# Altium schematic sheet Weather station GSM.SchDoc
size A3
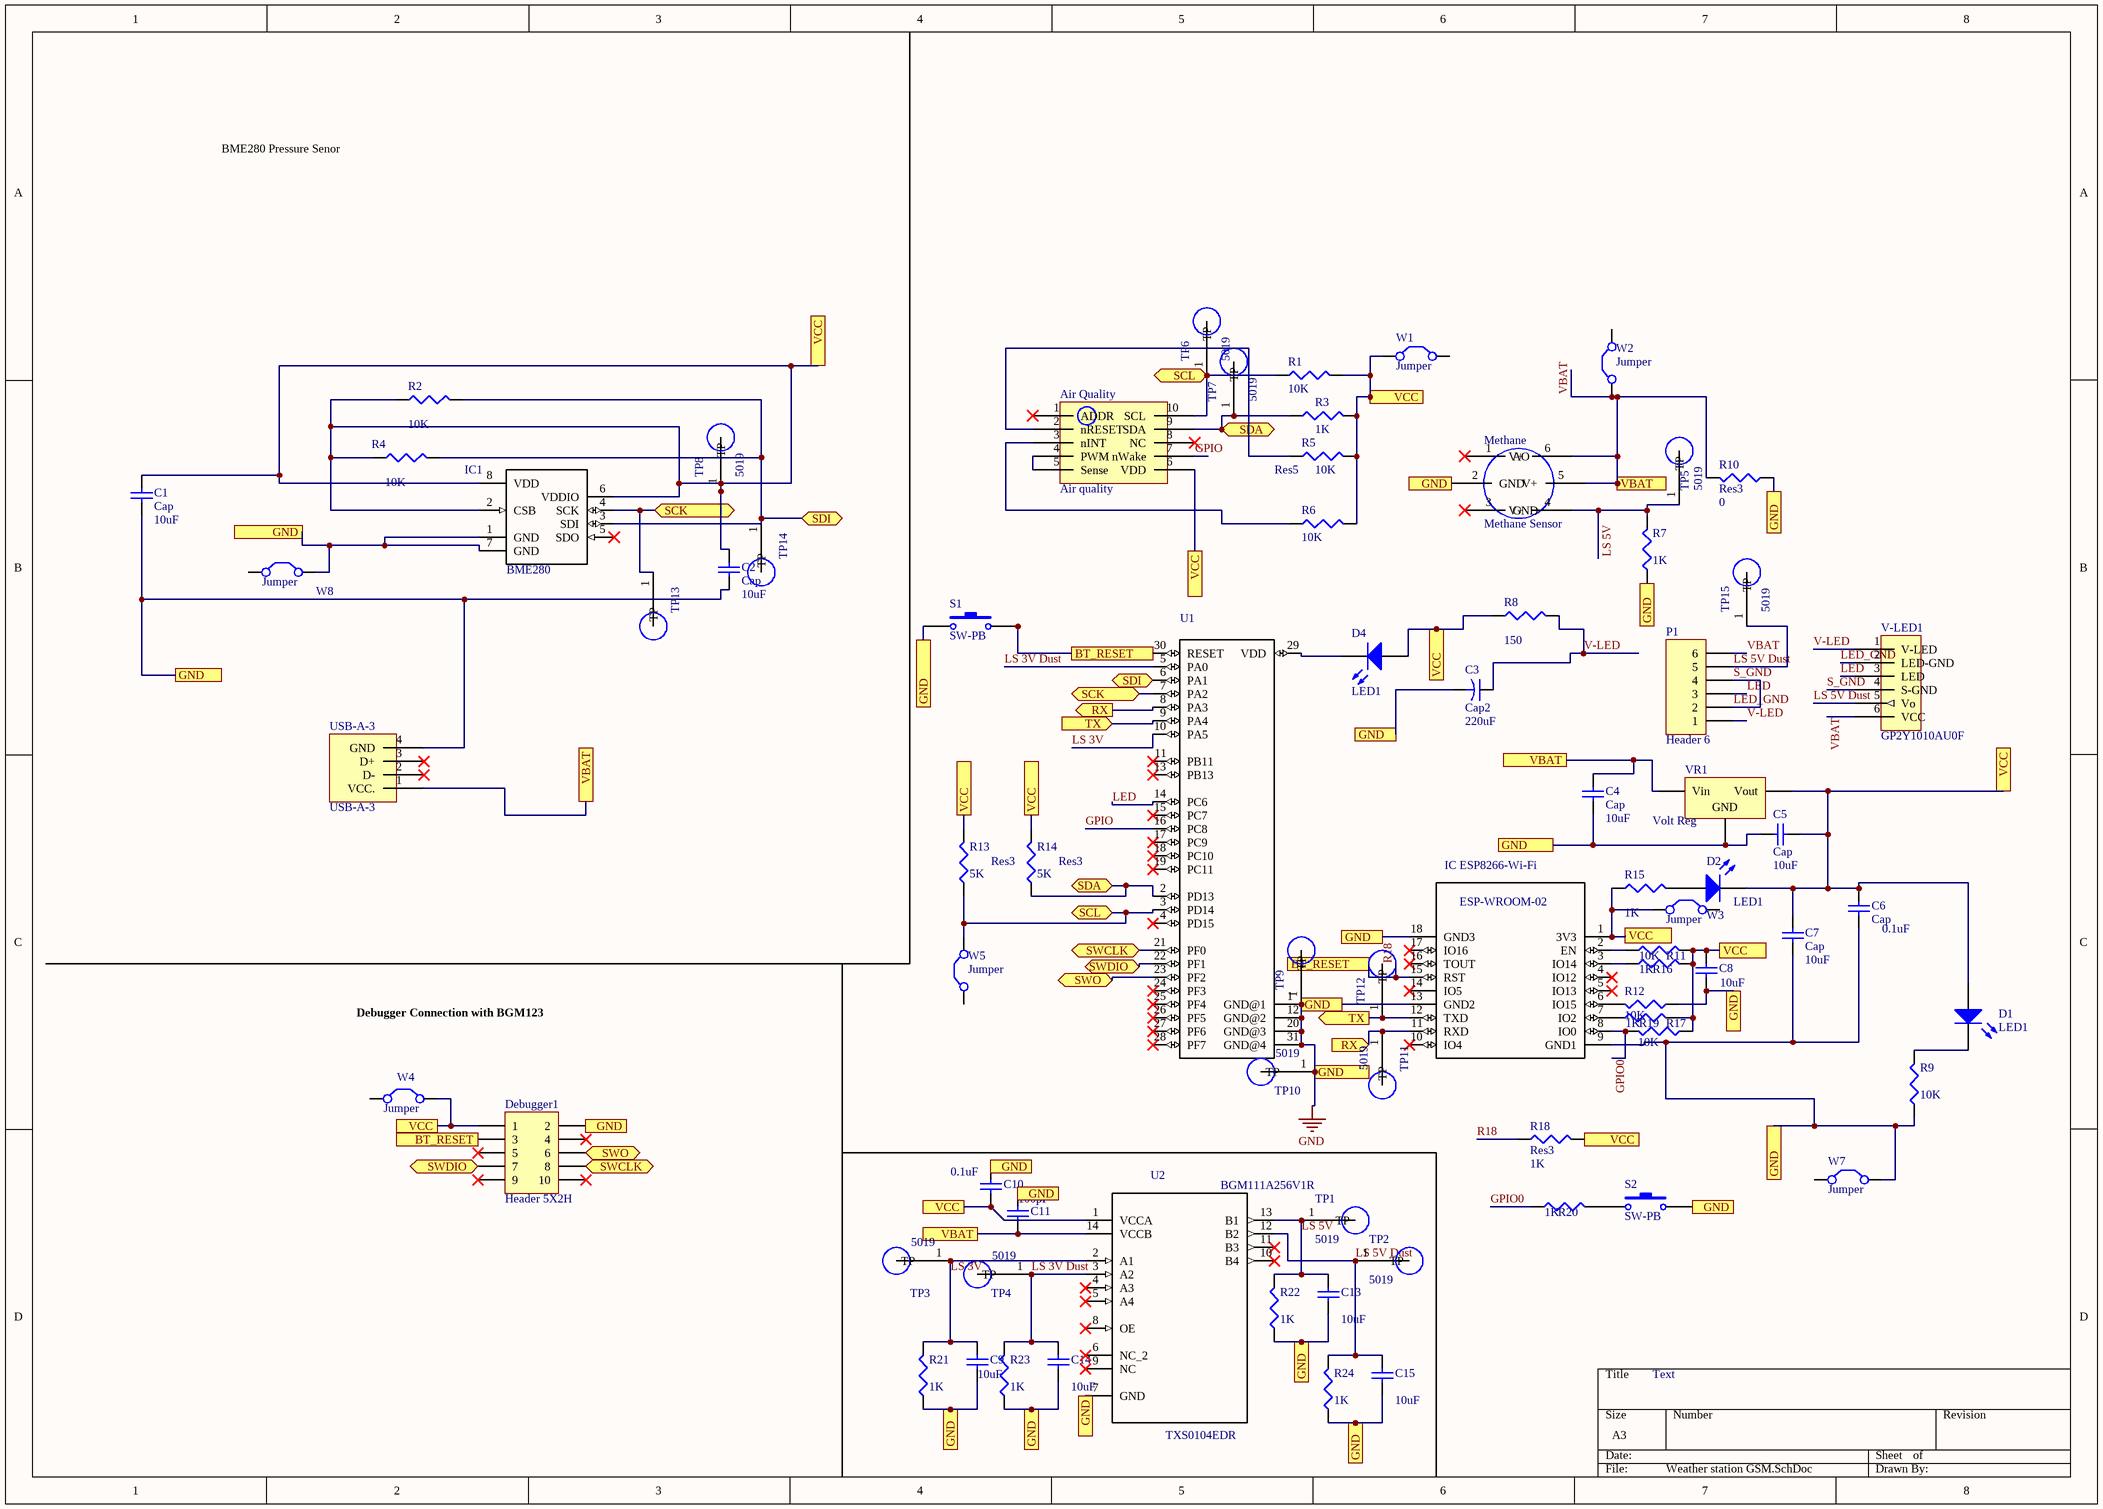
[diagram p0: Weather station GSM.SchDoc]

## Parts
Air_Quality  Air quality  [AirQuality]
C1  Cap  value 10uF  [RAD-0.3]
C2  Cap  value 10uF  [RAD-0.3]
C3  Cap2  value 220uF  [CAPR5-4X5]
C4  Cap  value 10uF  [RAD-0.3]
C5  Cap  value 10uF  [RAD-0.3]
C6  Cap  value 0.1uF  [RAD-0.3]
C7  Cap  value 10uF  [RAD-0.3]
C8  value 10uF  [RAD-0.3]  (hidden comment: Cap)
C9  value 10uF  [RAD-0.3]  (hidden comment: Cap)
C10  value 0.1uF  [RAD-0.3]  (hidden comment: Cap)
C11  value 100pF  [RAD-0.3]  (hidden comment: Cap)
C13  value 10uF  [RAD-0.3]  (hidden comment: Cap)
C14  value 10uF  [RAD-0.3]  (hidden comment: Cap)
C15  value 10uF  [RAD-0.3]  (hidden comment: Cap)
D1  LED1  [LED-1]
D2  LED1  [LED-1]
D4  LED1  [LED-1]
Debugger1  Header 5X2H  [HDR2X5H]
IC1  BME280  [BME280]
IC_ESP8266-Wi-Fi  ESP-WROOM-02  [FRONT-FACE]
Methane  Methane Sensor  [Methane Sensor]
P1  Header 6  [HDR1X6]
R1  value 10K  [C1206]  (hidden comment: Res3)
R2  value 10K  [J1-0603]  (hidden comment: Res3)
R3  value 1K  [C1206]  (hidden comment: Res3)
R4  value 10K  [J1-0603]  (hidden comment: Res3)
R5  Res5  value 10K  [J1-0603]
R6  value 10K  [J1-0603]  (hidden comment: Res3)
R7  value 1K  [J1-0603]  (hidden comment: Res3)
R8  value 150  [J1-0603]  (hidden comment: Res3)
R9  value 10K  [14-1210]  (hidden comment: Res3)
R10  Res3  value 0  [14-1210]
R11  value 10K  [J1-0603]  (hidden comment: Res3)
R12  value 10K  [14-1210]  (hidden comment: Res3)
R13  Res3  value 5K  [C1206]
R14  Res3  value 5K  [C1206]
R15  value 1K  [J1-0603]  (hidden comment: Res3)
R16  value 1K  [J1-0603]  (hidden comment: Res3)
R17  value 10K  [14-1210]  (hidden comment: Res3)
R18  Res3  value 1K  [J1-0603]
R19  value 1K  [J1-0603]  (hidden comment: Res3)
R20  value 1K  [J1-0603]  (hidden comment: Res3)
R21  value 1K  [14-1210]  (hidden comment: Res3)
R22  value 1K  [14-1210]  (hidden comment: Res3)
R23  value 1K  [14-1210]  (hidden comment: Res3)
R24  value 1K  [14-1210]  (hidden comment: Res3)
S1  SW-PB  [SPST-2]
S2  SW-PB  [SPST-2]
TP1  5019  [TP380X203]
TP2  5019  [TP380X203]
TP3  5019  [TP380X203]
TP4  5019  [TP380X203]
TP5  5019  [TP380X203]
TP6  5019  [TP380X203]
TP7  5019  [TP380X203]
TP8  5019  [TP380X203]
TP9  5019  [TP380X203]  (value not drawn)
TP10  5019  [TP380X203]
TP11  5019  [TP380X203]
TP12  5019  [TP380X203]  (value not drawn)
TP13  5019  [TP380X203]  (value not drawn)
TP14  5019  [TP380X203]  (value not drawn)
TP15  5019  [TP380X203]
U1  BGM111A256V1R  [XCVR_BGM111A256V1R]
U2  TXS0104EDR  [SOIC127P600X175-14N]
USB-A-3  USB-A-3  [USB3]
V-LED1  GP2Y1010AU0F
VR1  Volt Reg  [D2PAK_N]
W1  Jumper  [RAD-0.2]
W2  Jumper  [RAD-0.2]
W3  Jumper  [RAD-0.2]
W4  Jumper  [RAD-0.2]
W5  Jumper  [RAD-0.2]
W7  Jumper  [RAD-0.2]
W8  Jumper  [RAD-0.2]

## Ports
BT_RESET, GND, RX (in), RX (out), SCK (bidir), SCL (bidir), SDA (bidir), SDI (bidir), SWCLK (bidir), SWDIO (bidir), SWO (bidir), TX (in), TX (out), VBAT, VCC

## Nets
GND: C1.1 C2.1 C3.2 C4.1 C5.2 C6.1 C7.1 C8.1 C9.1 C10.2 C11.2 C13.1 C14.1 C15.1 Debugger1.2 IC1.1(GND) IC1.7(GND) IC_ESP8266-Wi-Fi.9(GND1) IC_ESP8266-Wi-Fi.13(GND2) IC_ESP8266-Wi-Fi.18(GND3) Methane.2(GND) R7.1 R9.1 R10.1 R12.1 R21.1 R22.1 R23.1 R24.1 S1.1 S2.2 TP9.1(TP) TP10.1(TP) U1.1(GND@1) U1.12(GND@2) U1.20(GND@3) U1.31(GND@4) U2.7(GND) USB-A-3.4(GND) VR1.2(GND) W7.2(C2) W8.2(C2) ; port GND
GPIO: Air_Quality.7(nWake) U1.16(PC8)
GPIO0: IC_ESP8266-Wi-Fi.8(IO0) R17.2 R20.1
LED: P1.3 U1.14(PC6) V-LED1.3(LED)
LED_GND: P1.2 P1.4 V-LED1.2(LED-GND) V-LED1.4(S-GND)  [also labelled S_GND]
LS 3V: C9.2 R21.2 TP3.1(TP) U1.10(PA5) U2.2(A1)
LS 3V Dust: C14.2 R23.2 TP4.1(TP) U1.5(PA0) U2.3(A2)
LS 5V: C13.2 Methane.4(V+) R7.2 R22.2 TP1.1(TP) TP5.1(TP) U2.13(B1)
LS 5V Dust: C15.2 P1.5 R24.2 TP2.1(TP) TP15.1(TP) U2.12(B2) V-LED1.5(Vo)
R18: Debugger1.3 IC_ESP8266-Wi-Fi.15(RST) R18.1 S1.2 U1.30(RESET) ; port BT_RESET
RX: IC_ESP8266-Wi-Fi.11(RXD) TP11.1(TP) U1.8(PA3) ; port RX
SCK: IC1.4(SCK) TP13.1(TP) U1.7(PA2) ; port SCK
SCL: Air_Quality.10(SCL) R1.1 R13.1 TP6.1(TP) U1.3(PD14) W5.2(C2) ; port SCL
SDA: Air_Quality.9(SDA) R3.1 R14.1 TP7.1(TP) U1.2(PD13) ; port SDA
SDI: IC1.3(SDI) R2.2 R4.2 TP14.1(TP) U1.6(PA1) ; port SDI
SWCLK: Debugger1.8 U1.21(PF0) ; port SWCLK
SWDIO: Debugger1.7 U1.22(PF1) ; port SWDIO
SWO: Debugger1.6 U1.23(PF2) ; port SWO
TX: IC_ESP8266-Wi-Fi.12(TXD) TP12.1(TP) U1.9(PA4) ; port TX
V-LED: C3.1 P1.1 R8.2 V-LED1.1(V-LED)
VBAT: C4.2 C11.1 Methane.5(V+) Methane.6(V+) P1.6 R10.2 U2.14(VCCB) USB-A-3.1(VCC.) V-LED1.6(VCC) VR1.1(Vin) W2.1(C1) ; port VBAT
VCC: Air_Quality.6(VDD) C1.2 C2.2 C5.1 C6.2 C7.2 C8.2 C10.1 D1.1(A) D2.2(K) D4.1(A) Debugger1.1 IC1.2(CSB) IC1.6(VDDIO) IC1.8(VDD) IC_ESP8266-Wi-Fi.1(3V3) R1.2 R2.1 R3.2 R4.1 R5.2 R6.2 R8.1 R11.2 R13.2 R14.2 R15.1 R16.2 R17.1 R18.2 R19.2 TP8.1(TP) U2.1(VCCA) VR1.3(Vout) W1.1(C1) W3.1(C1) W4.2(C2) ; port VCC
NetAir_Quality_2: Air_Quality.2(nRESET) R5.1
NetAir_Quality_3: Air_Quality.3(nINT) R6.1
NetAir_Quality_4: Air_Quality.4(PWM) Air_Quality.5(Sense)
NetD1_2: D1.2(K) R9.2
NetD2_1: D2.1(A) R15.2
NetD4_2: D4.2(K) U1.29(VDD)
NetIC_ESP8266-Wi-Fi_2: IC_ESP8266-Wi-Fi.2(EN) R11.1
NetIC_ESP8266-Wi-Fi_3: IC_ESP8266-Wi-Fi.3(IO14) R16.1
NetIC_ESP8266-Wi-Fi_6: IC_ESP8266-Wi-Fi.6(IO15) R12.2
NetIC_ESP8266-Wi-Fi_7: IC_ESP8266-Wi-Fi.7(IO2) R19.1
NetR20_2: R20.2 S2.1

Not connected (* = marked no-connect by the designer): Air_Quality 1(ADDR)* 8(NC)*; Debugger1 4* 5* 9* 10*; IC1 5(SDO)*; IC_ESP8266-Wi-Fi 4(IO12)* 5(IO13)* 10(IO4)* 14(IO5)* 16(TOUT)* 17(IO16)*; Methane 1(AO)* 3(GND)*; U1 4(PD15)* 11(PB11)* 13(PB13)* 15(PC7)* 17(PC9)* 18(PC10)* 19(PC11)* 24(PF3)* 25(PF4)* 26(PF5)* 27(PF6)* 28(PF7)*; U2 4(A3)* 5(A4)* 6(NC_2)* 8(OE)* 9(NC)* 10(B4)* 11(B3)*; USB-A-3 2(D-)* 3(D+)*; W1 2(C2); W2 2(C2); W3 2(C2); W4 1(C1); W5 1(C1); W7 1(C1); W8 1(C1)

## Notes on the sheet
- BME280 Pressure Senor
- Debugger Connection with BGM123
- Text

## Library data of the parts
C1 C2 C4-C11 C13-C15 = Cap: Capacitor; Published: 8-Jun-2000; LatestRevisionDate: 17-Jul-2002; LatestRevisionNote: Re-released for DXP Platform.; PackageReference: RAD-0.3; Publisher: Altium Limited; PackageDescription: Radial Cap, Thru-Hole; 2 Leads; 0.3 in Pin Spacing
C3 = Cap2: Capacitor; Published: 23-Sep-2002; PackageReference: CAPR5-4X5; Publisher: Altium Limited; PackageDescription: Capacitor; 2 Leads
D1 D2 D4 = LED1: Typical RED GaAs LED; Published: 8-Jun-2000; LatestRevisionDate: 08-Jul-2005; LatestRevisionNote: Mech Layer 1 removed.; PackageReference: LED-1; Publisher: Altium Limited; PackageDescription: LED; 2 Leads
Debugger1 = Header 5X2H: Header, 5-Pin, Dual row, Right Angle; LatestRevisionDate: 17-Jul-2002; LatestRevisionNote: Re-released for DXP Platform.; Publisher: Altium Limited
IC1 = BME280: SENSOR PRESSURE HUMIDITY TEMP; MF: Bosch; Price: 5.55 USD; Package: LGA-8 Bosch; MP: BME280; Availability: Good; Value: *
IC_ESP8266-Wi-Fi = ESP-WROOM-02: Wi-Fi Module w/ESP8266 802.11b/g/n 20dBm 20x18x3mm; MF: Espressif Systems; SnapEDA_Link: https://www.snapeda.com/symbols-footprints/ESP-WROOM-02/Espressif%20Systems/view-part/?ref=snap; Availability: Good; Price: 3.39 USD; MP: ESP-WROOM-02; Package: SMD-18 Espressif Systems; Value: *
Methane = Dust Sensor
P1 = Header 6: Header, 6-Pin; LatestRevisionDate: 17-Jul-2002; LatestRevisionNote: Re-released for DXP Platform.; Publisher: Altium Limited
R1-R24 = Res3: Resistor; Published: 8-Jun-2000; LatestRevisionDate: 29-May-2009; LatestRevisionNote: IPC-7351 Footprint Added.; PackageReference: J1-0603; Publisher: Altium Limited; PackageDescription: Chip Resistor
S1 S2 = SW-PB: Switch; Published: 24-Mar-1999; LatestRevisionDate: 17-Jul-2002; LatestRevisionNote: Re-released for DXP Platform.; PackageReference: SPST-2; Publisher: Altium Limited; PackageDescription: Switch; 2 Leads
TP1-TP15 = 5019: Phosphor Bronze Contact Miniature Silver Plated Surface Mount Test Points; MF: Keystone; SnapEDA_Link: https://www.snapeda.com/symbols-footprints/5019/Keystone%20Electronics/view-part/?ref=snap; Package: 2010 Keystone; Price: 0.18 USD; MP: 5019; Availability: Good; Value: *
U1 = BGM111A256V1R: Mod Blue Gecko 256k Flash 32qfn; MF: Silicon Labs; Package: QFN-32 Silicon Labs; Availability: Unavailable; MP: BGM111A256V1R; Price: 6.69 USD; Value: *
U2 = TXS0104EDR: 4-Bit Bidirectional Voltage-Level Shifter for Open-Drain and Push-Pull Applications 14-SOIC -40 to 85; MF: Texas Instruments; Availability: Unavailable; SnapEDA_Link: https://www.snapeda.com/symbols-footprints/TXS0104EDR/Texas%20Instruments/view-part/?ref=snap; Price: None; Package: SOIC-14 Texas Instruments; MP: TXS0104EDR; Value: *
VR1 = Volt Reg: Voltage Regulator; Published: 24-Mar-1999; LatestRevisionDate: 29-May-2009; LatestRevisionNote: IPC-7351 Footprint Added.; PackageReference: D2PAK; Publisher: Altium Limited; PackageDescription: 3-Pin Transistor Outline Package 2.54 mm Pitch, 15.1 mm Lead Span
W1-W5 W7 W8 = Jumper: Jumper Wire; Published: 24-Mar-1999; LatestRevisionDate: 17-Jul-2002; LatestRevisionNote: Re-released for DXP Platform.; PackageReference: RAD-0.2; Publisher: Altium Limited; PackageDescription: Radial Cap, Thru-Hole; 2 Leads; 0.2 in Pin Spacing